# EAGLE design Parameter-Board (EAGLE 6.1)
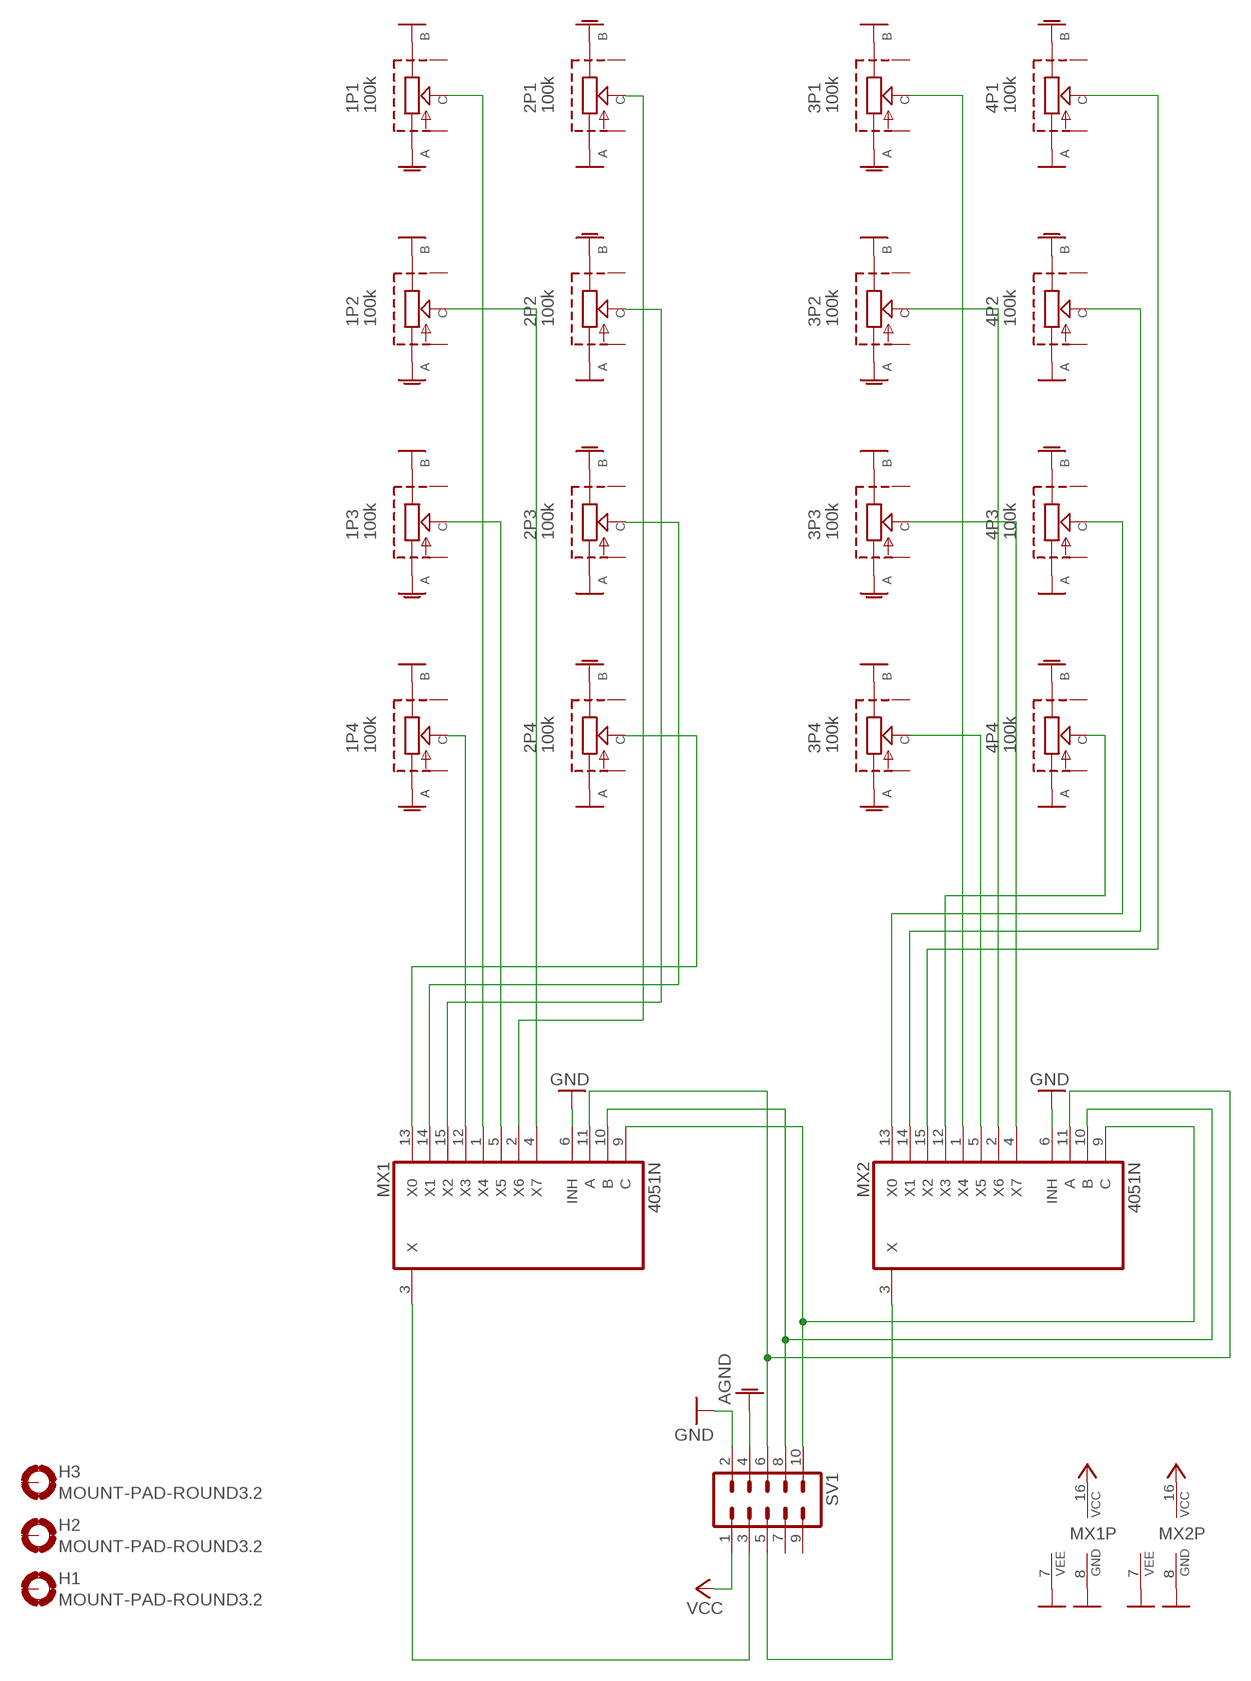
[diagram p0: schematic, sheet 1]

## Parts
1P1  100k  RK09K113  [RK09K113]
1P2  100k  RK09K113  [RK09K113]
1P3  100k  RK09K113  [RK09K113]
1P4  100k  RK09K113  [RK09K113]
2P1  100k  RK09K113  [RK09K113]
2P2  100k  RK09K113  [RK09K113]
2P3  100k  RK09K113  [RK09K113]
2P4  100k  RK09K113  [RK09K113]
3P1  100k  RK09K113  [RK09K113]
3P2  100k  RK09K113  [RK09K113]
3P3  100k  RK09K113  [RK09K113]
3P4  100k  RK09K113  [RK09K113]
4P1  100k  RK09K113  [RK09K113]
4P2  100k  RK09K113  [RK09K113]
4P3  100k  RK09K113  [RK09K113]
4P4  100k  RK09K113  [RK09K113]
H1  MOUNT-PAD-ROUND3.2  [3,2-PAD]
H2  MOUNT-PAD-ROUND3.2  [3,2-PAD]
H3  MOUNT-PAD-ROUND3.2  [3,2-PAD]
MX1  4051N  [DIL16]
MX2  4051N  [DIL16]
SV1  ML10  [ML10]

## Nets
0MX1: 2P4.C MX1.13(X0)
0MX2: 4P3.C MX2.13(X0)
1MX1: 2P3.C MX1.14(X1)
1MX2: 4P2.C MX2.14(X1)
2MX1: 2P2.C MX1.15(X2)
2MX2: 4P1.C MX2.15(X2)
3MX1: 1P4.C MX1.12(X3)
3MX2: 4P4.C MX2.12(X3)
4MX1: 1P1.C MX1.1(X4)
4MX2: 3P1.C MX2.1(X4)
5MX1: 1P3.C MX1.5(X5)
5MX2: 3P4.C MX2.5(X5)
6MX1: 2P1.C MX1.2(X6)
6MX2: 3P2.C MX2.2(X6)
7MX1: 1P2.C MX1.4(X7)
7MX2: 3P3.C MX2.4(X7)
A: MX1.11(A) MX2.11(A) SV1.6
AGND: 1P1.A 1P2.A 1P3.A 1P4.A 2P1.B 2P2.B 2P3.B 2P4.B 3P1.A 3P2.A 3P3.A 3P4.A 4P1.B 4P2.B 4P3.B 4P4.B SV1.4
B: MX1.10(B) MX2.10(B) SV1.8
C: MX1.9(C) MX2.9(C) SV1.10
GND [supply]: 1P1.B 1P2.B 1P3.B 1P4.B 2P1.A 2P2.A 2P3.A 2P4.A 3P1.B 3P2.B 3P3.B 3P4.B 4P1.A 4P2.A 4P3.A 4P4.A MX1.6(INH) MX1.7(VEE) MX1.8(GND) MX2.6(INH) MX2.7(VEE) MX2.8(GND) SV1.2
VCC: MX1.16(VCC) MX2.16(VCC) SV1.1
X1: MX1.3(X) SV1.3
X2: MX2.3(X) SV1.5
Unconnected: 1P1.CASE1 1P1.CASE2 1P2.CASE1 1P2.CASE2 1P3.CASE1 1P3.CASE2 1P4.CASE1 1P4.CASE2 2P1.CASE1 2P1.CASE2 2P2.CASE1 2P2.CASE2 2P3.CASE1 2P3.CASE2 2P4.CASE1 2P4.CASE2 3P1.CASE1 3P1.CASE2 3P2.CASE1 3P2.CASE2 3P3.CASE1 3P3.CASE2 3P4.CASE1 3P4.CASE2 4P1.CASE1 4P1.CASE2 4P2.CASE1 4P2.CASE2 4P3.CASE1 4P3.CASE2 4P4.CASE1 4P4.CASE2 H1.B3,2(MOUNT) H2.B3,2(MOUNT) H3.B3,2(MOUNT) SV1.7 SV1.9

## Library data of the parts
1P1-1P4 2P1-2P4 3P1-3P4 4P1-4P4 = alps:RK09K: Insulated Shaft Potentiometer ALPS Electric Co 9mm Size Snap-in Insulated Shaft Type RK09K -111: horizontal Package -113: vertical Package Reichelt Part No. RK09K111-/RK09K113- LIN10K, 50K, 100K LOG10K, 50K, 100K
H1-H3 = holes:MOUNT-PAD-ROUND: MOUNTING PAD, round
MX1 MX2 = 40xx:4051: 8-channel ANALOG MULTIPLEXER
SV1 = con-harting-ml:ML10: HARTING; OC_FARNELL: unknown; OC_NEWARK: unknown

## Net classes
0 default: width 0.254 mm
1 supply: width 0.406 mm

## Board
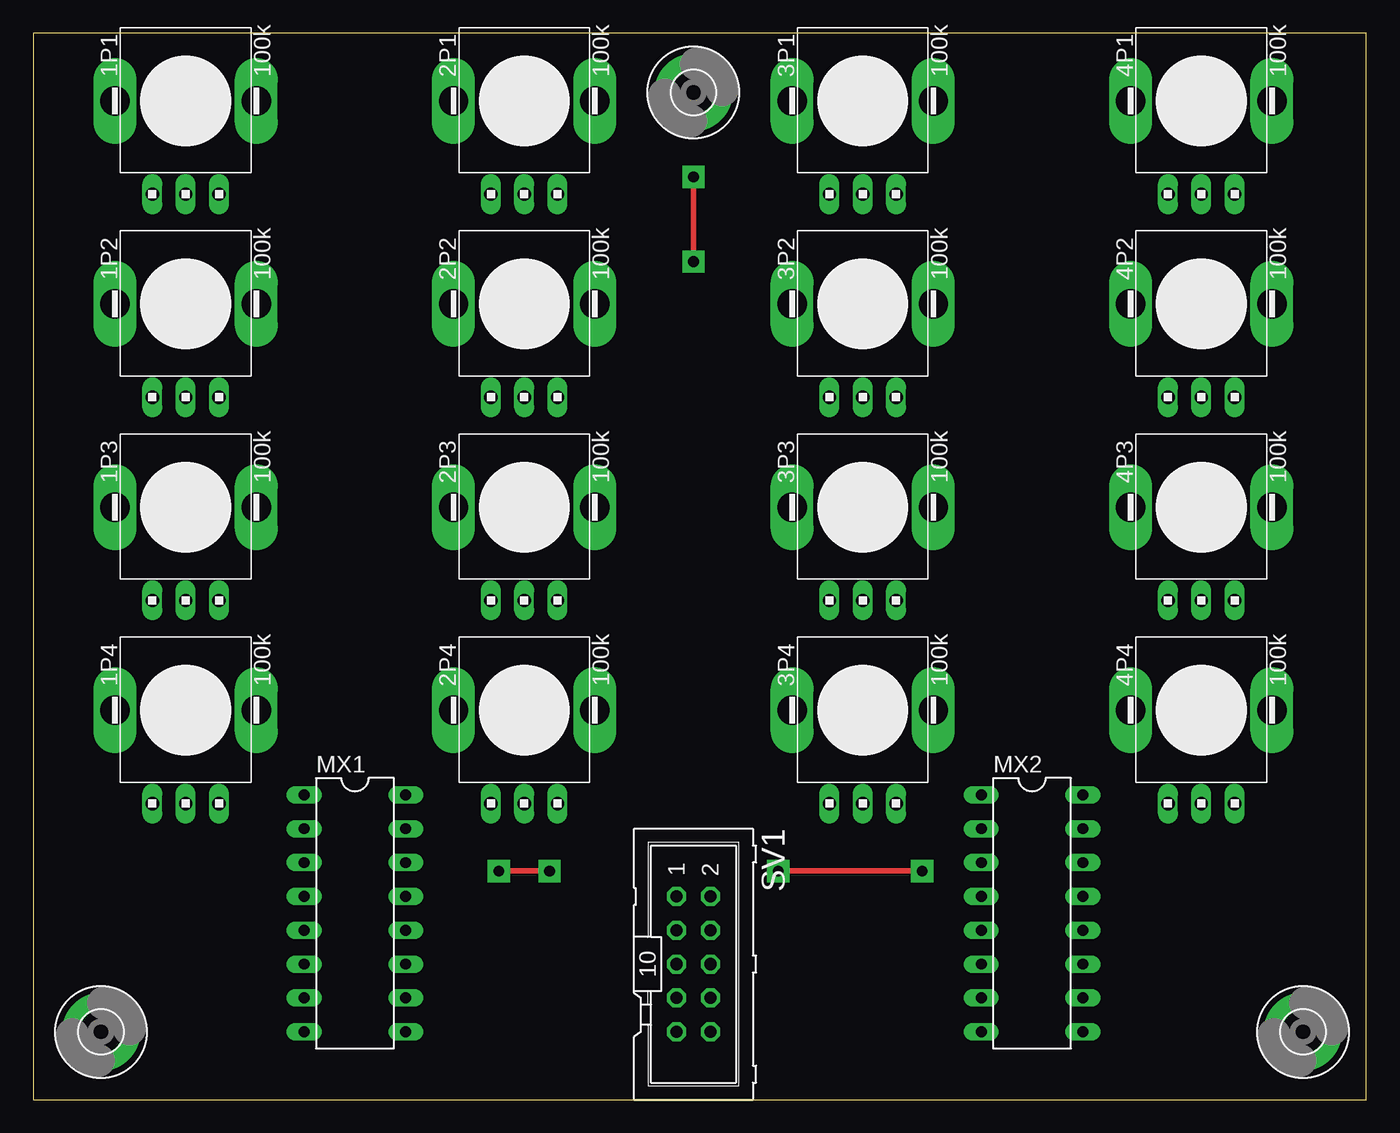
[diagram p1: board, top side]
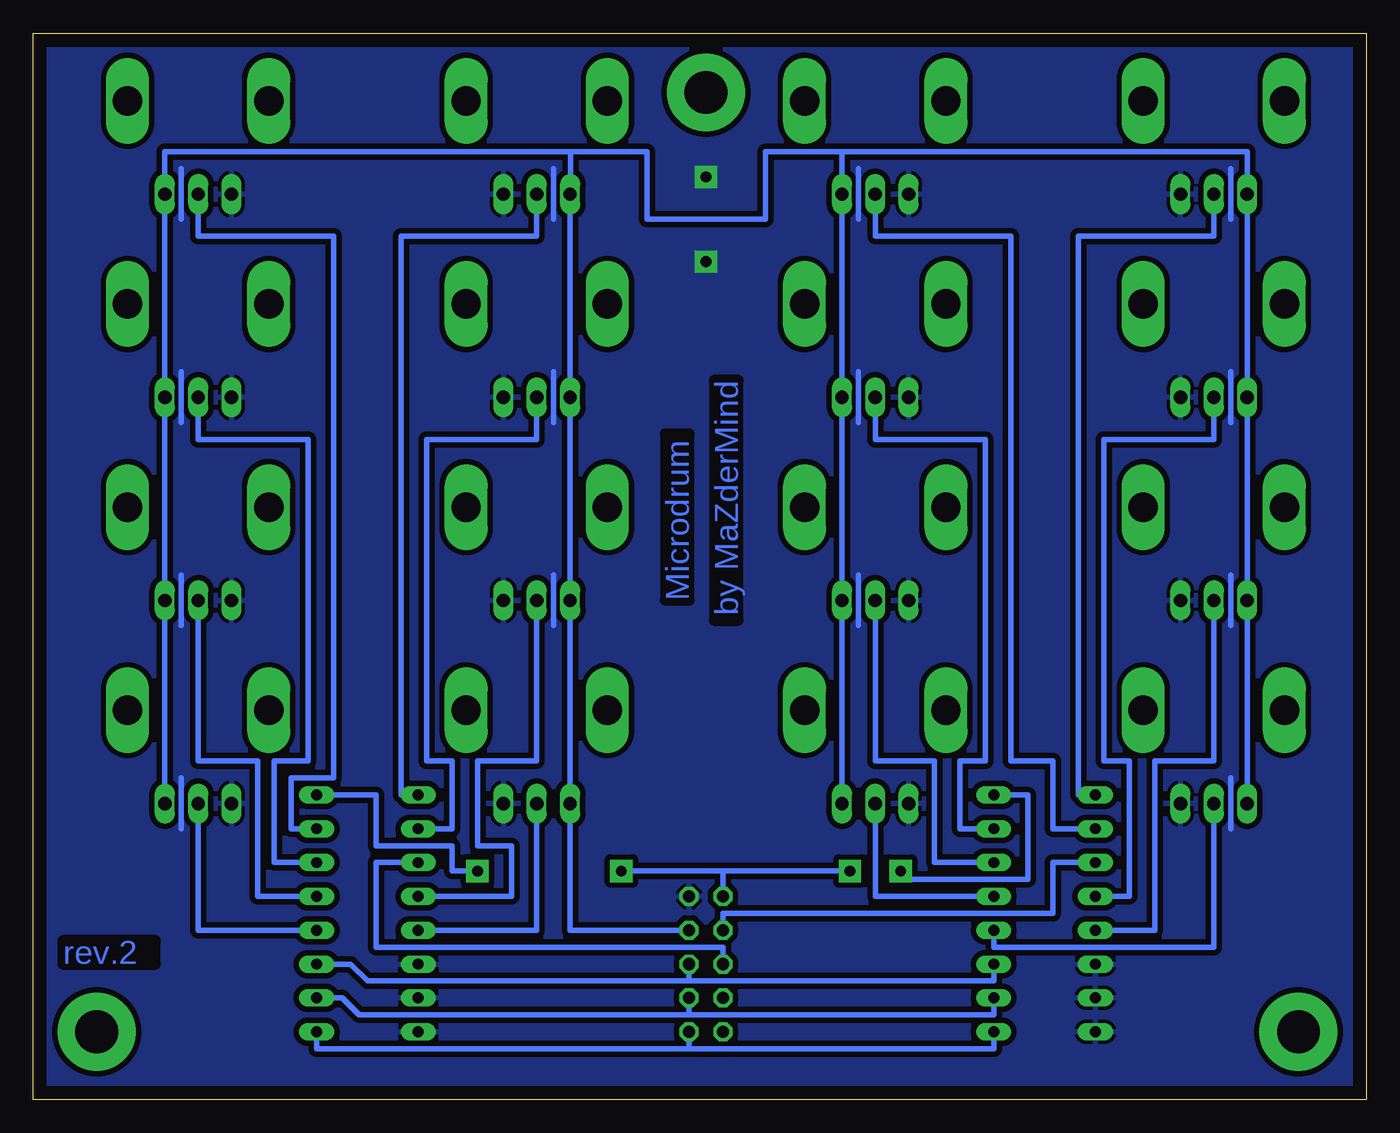
[diagram p2: board, bottom side, seen from below]

Size 100 x 80 mm. Coordinates in mm from the lower left corner, seen from the top.
Outline: 0,0 100,0 100,80 0,80 0,0
Copper layers (1*16): Top 0.035mm / dielectric 1.5mm / Bottom 0.035mm
Design rules: minimum track width 10mil, minimum drill 24mil, track to track 8mil, track to pad 8mil, pad to pad 8mil, via to via 8mil, smd to smd 8mil, copper to edge 40mil, drill to drill 8mil, minimum pad ring 10mil, minimum via ring 8mil, stop-mask expansion 4mil, vias tented up to drill 0mil, thermal gap 10mil

### Footprints (pad centres in the part's own frame; a part is rotated, then mirrored left to right if it is on the bottom)
RK09K113 = drill 1 long: A -2.5,-7; B 2.5,-7; C 0,-7 | drill 2.2 long: CASE1 -5.3,0; CASE2 5.3,0
3,2-PAD = drill 3.2 pad 5.842: B3,2 0,0
DIL16 = drill 0.813 long: 1 -8.89,-3.81; 2 -6.35,-3.81; 3 -3.81,-3.81; 4 -1.27,-3.81; 5 1.27,-3.81; 6 3.81,-3.81; 7 6.35,-3.81; 8 8.89,-3.81; 9 8.89,3.81; 10 6.35,3.81; 11 3.81,3.81; 12 1.27,3.81; 13 -1.27,3.81; 14 -3.81,3.81; 15 -6.35,3.81; 16 -8.89,3.81
ML10 = drill 0.914 octagon: 1 -5.08,-1.27; 2 -5.08,1.27; 3 -2.54,-1.27; 4 -2.54,1.27; 5 0,-1.27; 6 0,1.27; 7 2.54,-1.27; 8 2.54,1.27; 9 5.08,-1.27; 10 5.08,1.27

### Placement (x,y rotation side)
1P1  11.43,74.93 0 top
1P2  11.43,59.69 0 top
1P3  11.43,44.45 0 top
1P4  11.43,29.21 0 top
2P1  36.83,74.93 0 top
2P2  36.83,59.69 0 top
2P3  36.83,44.45 0 top
2P4  36.83,29.21 0 top
3P1  62.23,74.93 0 top
3P2  62.23,59.69 0 top
3P3  62.23,44.45 0 top
3P4  62.23,29.21 0 top
4P1  87.63,74.93 0 top
4P2  87.63,59.69 0 top
4P3  87.63,44.45 0 top
4P4  87.63,29.21 0 top
H1  5.08,5.08 0 top
H2  95.25,5.08 0 top
H3  49.53,75.56 0 top
MX1  24.13,13.97 270 top
MX2  74.93,13.97 270 top
SV1  49.53,10.16 270 top

### Tracks (layer width: path | path; a pad name or v marks a point on that pad's centre or on a via)
0MX1
  Bottom 0.406: 2P4.C 36.83,15.24 MX1.13
0MX2
  Bottom 0.406: MX2.13 83.19,15.24 83.19,25.4 87.63,25.4 4P3.C
1MX1
  Bottom 0.406: MX1.14 32.38,17.78 32.38,25.4 36.83,25.4 2P3.C
1MX2
  Bottom 0.406: MX2.14 81.92,17.78 81.92,25.4 79.38,25.4 79.38,49.53 87.63,49.53 4P2.C
2MX1
  Bottom 0.406: MX1.15 30.48,20.32 30.48,25.4 28.57,25.4 28.57,49.53 36.83,49.53 2P2.C
2MX2
  Bottom 0.406: MX2.15 80.64,20.32 80.64,24.13 77.47,24.13 77.47,64.77 87.63,64.77 4P1.C
3MX1
  Bottom 0.406: 1P4.C 11.43,11.43 27.94,11.43 MX1.12
3MX2
  Bottom 0.406: 4P4.C 87.63,12.7 MX2.12
4MX1
  Bottom 0.406: 1P1.C 11.43,64.77 21.59,64.77 21.59,22.86 MX1.1
4MX2
  Bottom 0.406: MX2.1 72.39,22.86 72.39,64.77 62.23,64.77 3P1.C
5MX1
  Bottom 0.406: MX1.5 15.88,12.7 15.88,25.4 11.43,25.4 1P3.C
5MX2
  Bottom 0.406: 3P4.C 62.23,12.7 MX2.5
6MX1
  Bottom 0.406: 2P1.C 36.83,64.77 26.67,64.77 26.67,25.4 23.5,25.4 23.5,20.32 MX1.2
6MX2
  Bottom 0.406: MX2.2 68.58,20.32 68.58,25.4 70.48,25.4 70.48,49.53 62.23,49.53 3P2.C
7MX1
  Bottom 0.406: MX1.4 17.78,15.24 17.78,25.4 19.68,25.4 19.68,49.53 11.43,49.53 1P2.C
7MX2
  Bottom 0.406: MX2.4 64.14,15.24 64.14,19.05 66.67,19.05 66.67,25.4 62.23,25.4 3P3.C
A
  Bottom 0.406: MX1.11 27.94,8.89 50.8,8.89 | 50.8,8.89 SV1.6 | MX2.11 76.2,10.16 74.93,8.89 50.8,8.89
AGND
  Bottom 0.406: 1P4.A 1P3.A 1P2.A 1P1.A 8.93,71.12 39.33,71.12 | 39.33,71.12 2P1.B 2P2.B 2P3.B 2P4.B | SV1.4 59.73,12.7 3P4.A 3P3.A 3P2.A 3P1.A 59.69,67.93 59.69,71.12 | 59.69,71.12 53.98,71.12 53.98,66.04 45.09,66.04 45.09,71.12 39.33,71.12 | 4P4.B 4P3.B 4P2.B 4P1.B 90.13,71.12 59.69,71.12
B
  Bottom 0.406: MX1.10 27.94,6.35 50.8,6.35 | 50.8,6.35 SV1.8 | MX2.10 76.83,7.62 75.56,6.35 50.8,6.35
C
  Bottom 0.406: MX1.9 27.94,3.81 50.8,3.81 | SV1.10 50.8,3.81 | 50.8,3.81 78.74,3.81 MX2.9
GND  (via drill 0.8 pad 1.68)
  Top 0.406: v49.53,69.22 v49.53,62.87
  Bottom 0.406: 60.96,35.56 60.96,39.37 | 60.96,50.8 60.96,54.61 | 60.96,66.04 60.96,69.85 | 88.9,66.04 88.9,69.85 | 88.9,50.8 88.9,54.61 | 38.1,35.56 38.1,39.37 | 38.1,50.8 38.1,54.61 | 38.1,66.04 38.1,69.85 | 10.16,66.04 10.16,69.85 | 10.16,50.8 10.16,54.61 | 10.16,35.56 10.16,39.37 | 10.16,20.32 10.16,24.13 | 88.9,35.56 88.9,39.37 | 88.9,20.32 88.9,24.13
  pour Bottom (isolate 0.406): 0,0 0,80.01 100.33,80.01 100.33,0
VCC  (via drill 0.8 pad 1.68)
  Top 0.406: v34.92,17.14 v38.73,17.14 | v66.67,17.14 v55.88,17.14
  Bottom 0.406: MX1.16 25.4,22.86 25.4,16.51 34.92,16.51 v34.92,17.14 | v38.73,17.14 48.26,17.14 | 48.26,17.14 SV1.1 | MX2.16 74.3,22.86 74.3,19.05 68.58,19.05 68.58,17.14 v66.67,17.14 | v55.88,17.14 48.26,17.14
X1
  Bottom 0.406: SV1.3 48.26,13.97 23.5,13.97 23.5,17.78 MX1.3
X2
  Bottom 0.406: SV1.5 48.26,11.43 74.3,11.43 74.3,17.78 MX2.3

### Text on the board
Bottom: by MaZderMind | Microdrum | rev.2